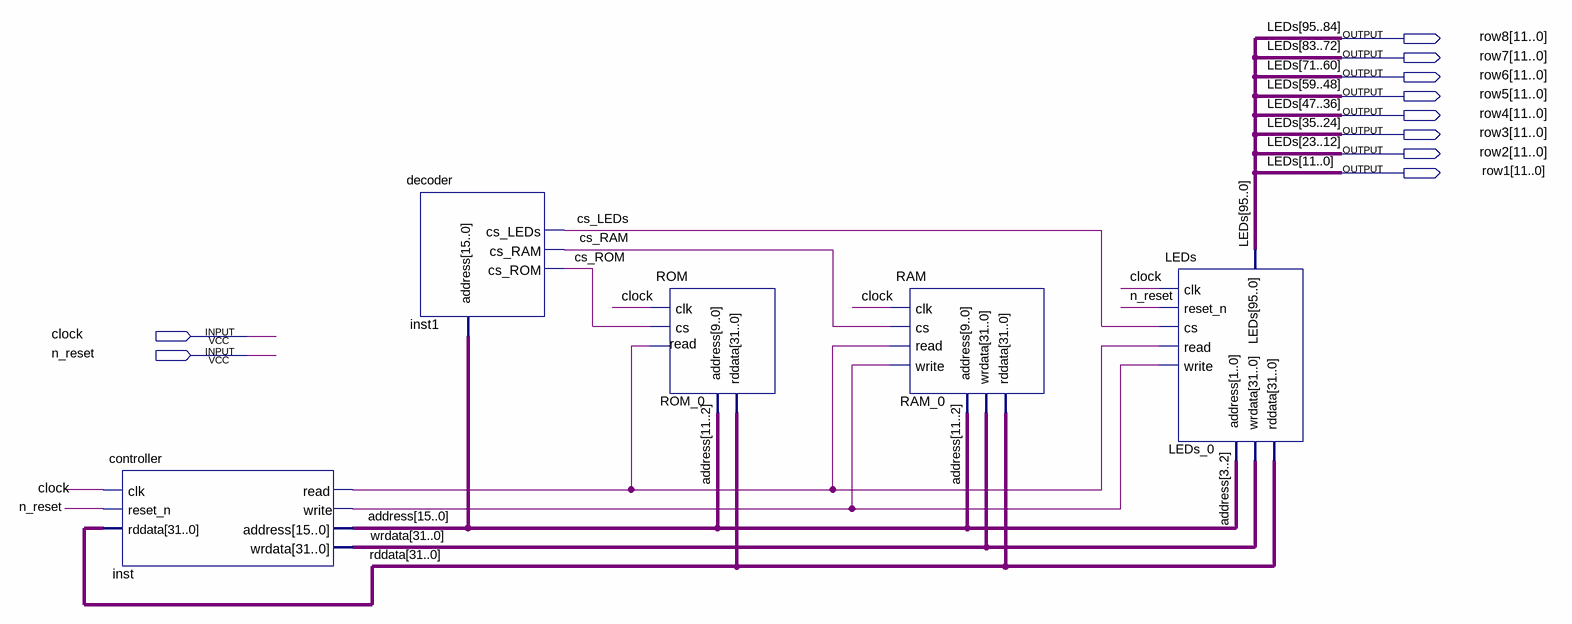
[diagram p0: schematic sheet]
// Quartus schematic GECKO.bdf as structural Verilog: 5 symbols, 10 pins
module GECKO (
  input  clock,
  input  n_reset,
  output [11:0] row8,
  output [11:0] row7,
  output [11:0] row6,
  output [11:0] row5,
  output [11:0] row4,
  output [11:0] row3,
  output [11:0] row2,
  output [11:0] row1
);

  wire cs_LEDs, cs_RAM, cs_ROM, inst_read, inst_write;
  wire [15:0] address;
  wire [31:0] rddata, wrdata;

  controller inst (
    .clk(clock), .reset_n(n_reset), .rddata(rddata), .read(inst_read), .write(inst_write), .address(address),
    .wrdata(wrdata));
  decoder inst1 (.address(address), .cs_RAM(cs_RAM), .cs_ROM(cs_ROM), .cs_LEDs(cs_LEDs));
  ROM ROM_0 (.clk(clock), .cs(cs_ROM), .read(inst_read), .address(address[11:2]), .rddata(rddata));
  RAM RAM_0 (
    .clk(clock), .cs(cs_RAM), .write(inst_write), .wrdata(wrdata), .read(inst_read), .address(address[11:2]),
    .rddata(rddata));
  LEDs LEDs_0 (
    .clk(clock), .reset_n(n_reset), .cs(cs_LEDs), .write(inst_write), .address(address[3:2]),
    .wrdata(wrdata), .read(inst_read), .rddata(rddata),
    .LEDs({row8, row7, row6, row5, row4, row3, row2, row1}));

  // Other names for the same wires on the sheet: LEDs[95:0] = {row8, row7, row6, row5, row4, row3, row2, row1}
endmodule
